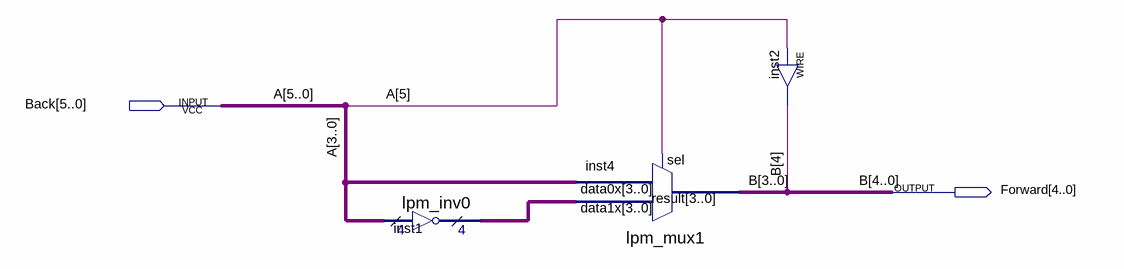
[diagram p0: schematic sheet]
// Quartus schematic B6toF5.bdf as structural Verilog: 3 symbols, 2 pins
module B6toF5 (
  input  [5:0] Back,
  output [4:0] Forward
);

  wire [3:0] inst1_result;

  lpm_inv0 inst1 (.data(Back[3:0]), .result(inst1_result));
  lpm_mux1 inst4 (.data1x(inst1_result), .data0x(Back[3:0]), .sel(Back[5]), .result(Forward[3:0]));
  assign Forward[4] = Back[5];  // WIRE inst2

  // Other names for the same wires on the sheet: A[5:0] = Back; B[4:0] = Forward
endmodule
